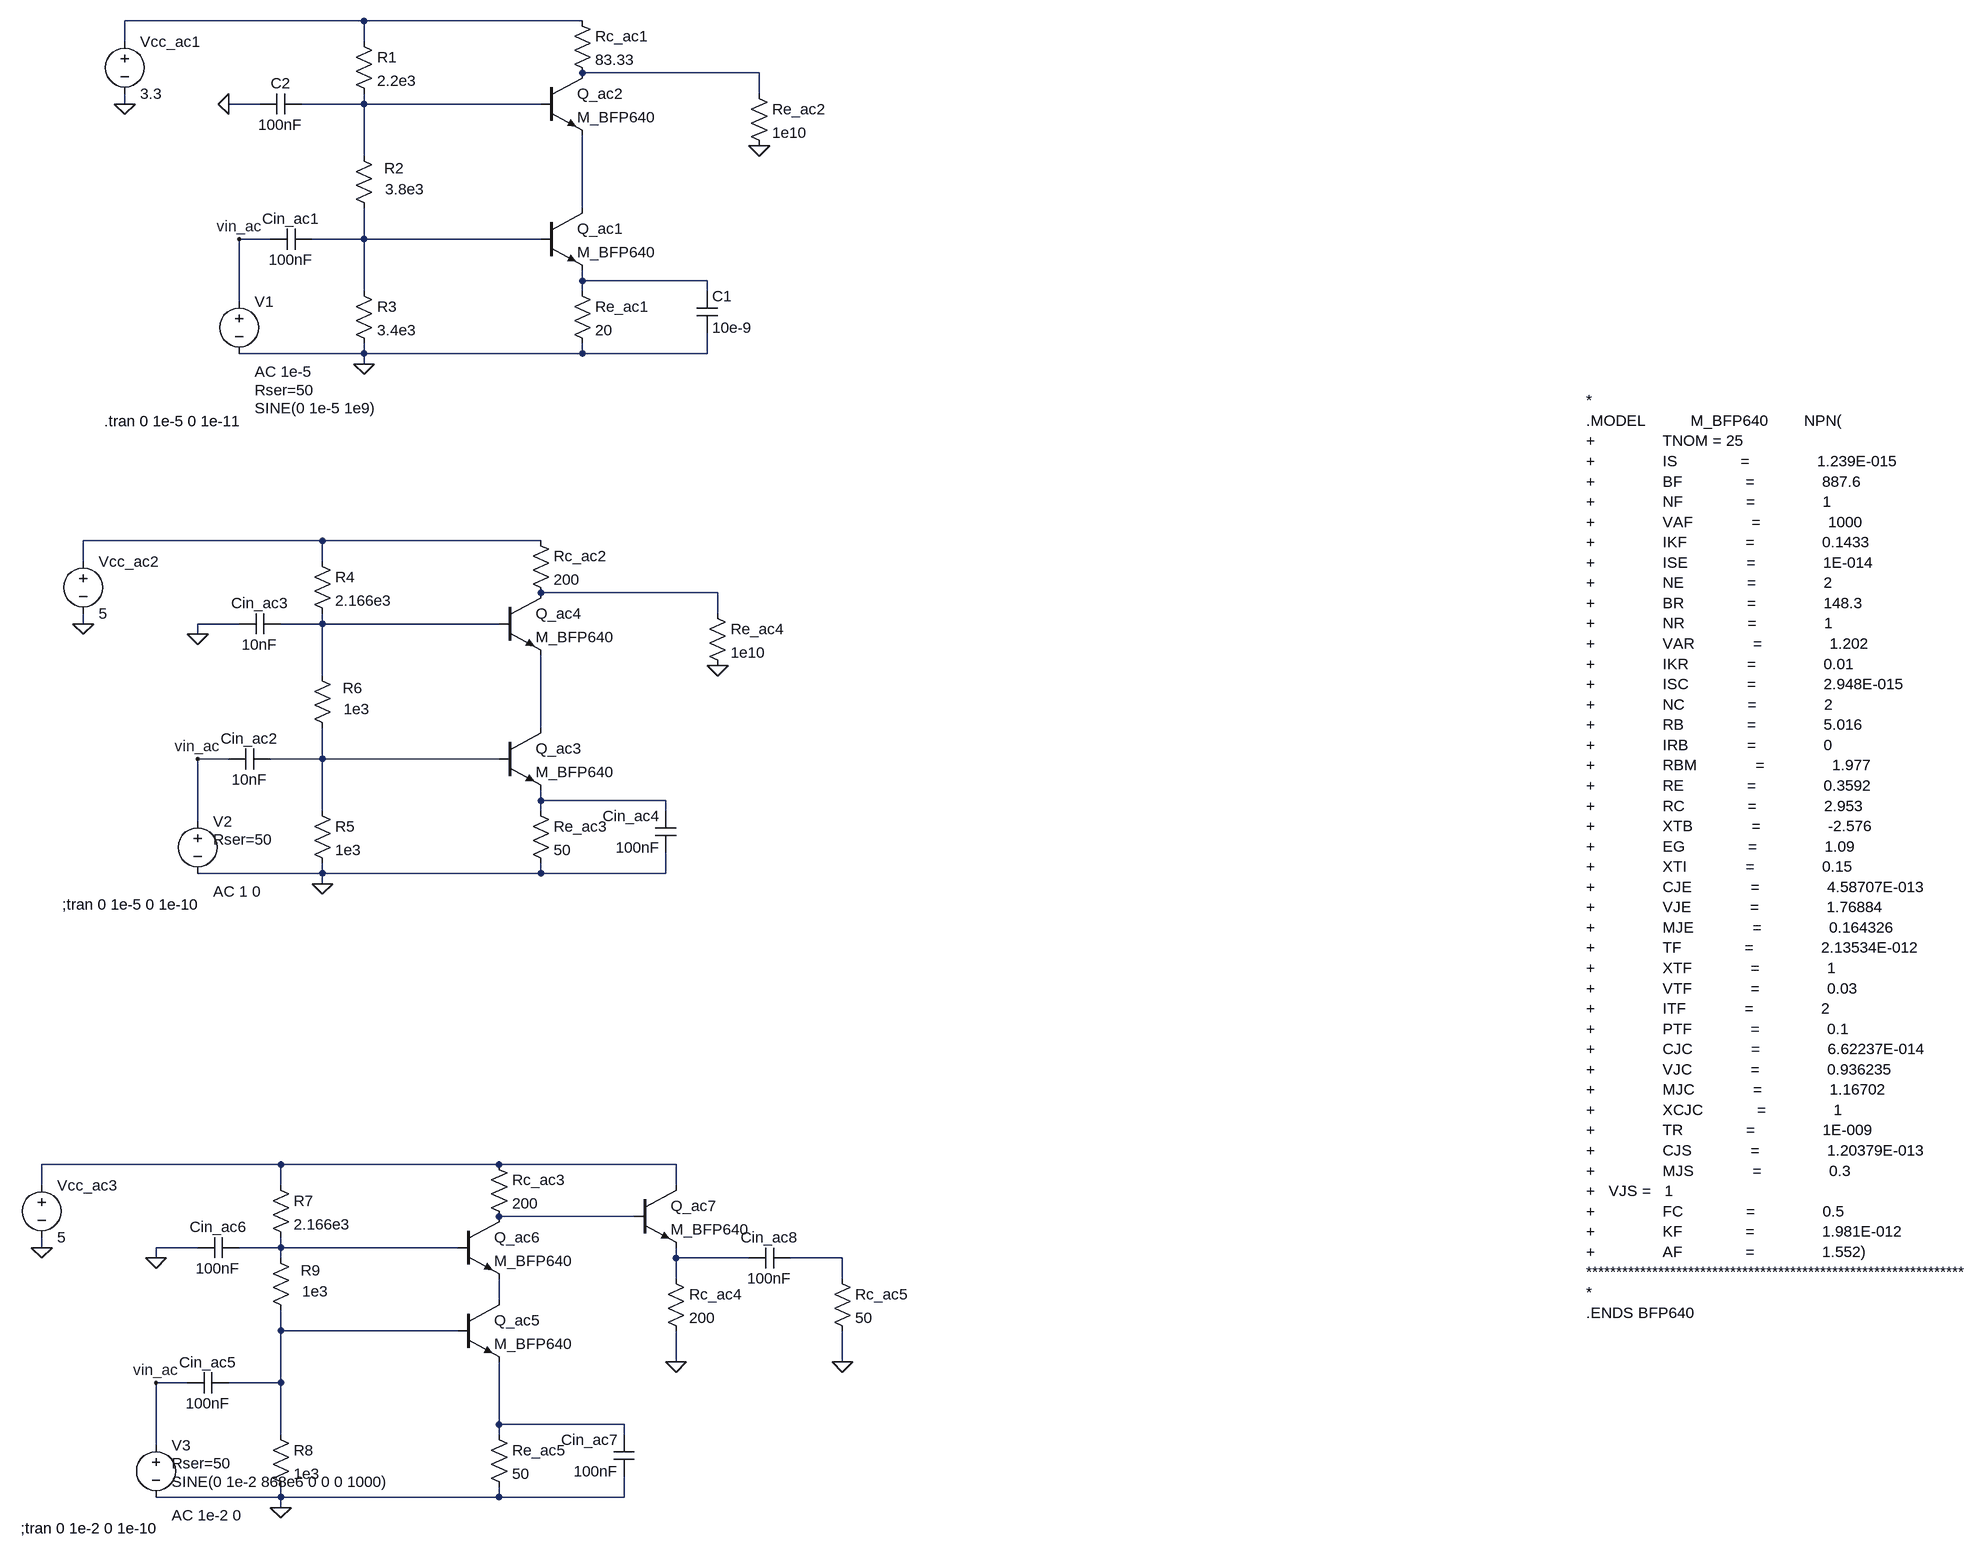
[diagram p0: schematic BP640_CASCODE.asc]
BP640_CASCODE.asc, the LTspice schematic file:
Version 4
SHEET 1 2516 2144
WIRE -288 -192 -656 -192
WIRE 48 -192 -288 -192
WIRE -656 -160 -656 -192
WIRE -288 -160 -288 -192
WIRE 320 -112 48 -112
WIRE 320 -80 320 -112
WIRE -656 -64 -656 -80
WIRE -448 -64 -496 -64
WIRE -288 -64 -288 -80
WIRE -288 -64 -384 -64
WIRE -16 -64 -288 -64
WIRE -288 16 -288 -64
WIRE 48 96 48 -16
WIRE -432 144 -480 144
WIRE -288 144 -288 96
WIRE -288 144 -368 144
WIRE -16 144 -288 144
WIRE 48 208 48 192
WIRE 240 208 48 208
WIRE -288 224 -288 144
WIRE 48 224 48 208
WIRE 240 224 240 208
WIRE -480 240 -480 144
WIRE -288 320 -288 304
WIRE -288 320 -480 320
WIRE 48 320 48 304
WIRE 48 320 -288 320
WIRE 240 320 240 288
WIRE 240 320 48 320
WIRE -288 336 -288 320
WIRE -352 608 -720 608
WIRE -16 608 -352 608
WIRE -720 640 -720 608
WIRE -352 640 -352 608
WIRE 256 688 -16 688
WIRE 256 720 256 688
WIRE -720 736 -720 720
WIRE -480 736 -544 736
WIRE -352 736 -352 720
WIRE -352 736 -416 736
WIRE -80 736 -352 736
WIRE -544 752 -544 736
WIRE -352 816 -352 736
WIRE -16 896 -16 784
WIRE -496 944 -544 944
WIRE -352 944 -352 896
WIRE -352 944 -432 944
WIRE -80 944 -352 944
WIRE -16 1008 -16 992
WIRE 176 1008 -16 1008
WIRE -352 1024 -352 944
WIRE -16 1024 -16 1008
WIRE 176 1024 176 1008
WIRE -544 1040 -544 944
WIRE -352 1120 -352 1104
WIRE -352 1120 -544 1120
WIRE -16 1120 -16 1104
WIRE -16 1120 -352 1120
WIRE 176 1120 176 1088
WIRE 176 1120 -16 1120
WIRE -352 1136 -352 1120
WIRE -416 1568 -784 1568
WIRE -80 1568 -416 1568
WIRE 192 1568 -80 1568
WIRE -784 1600 -784 1568
WIRE -416 1600 -416 1568
WIRE 192 1600 192 1568
WIRE 128 1648 -80 1648
WIRE -784 1696 -784 1680
WIRE -544 1696 -608 1696
WIRE -416 1696 -416 1680
WIRE -416 1696 -480 1696
WIRE -144 1696 -416 1696
WIRE -608 1712 -608 1696
WIRE -416 1712 -416 1696
WIRE 192 1712 192 1696
WIRE 304 1712 192 1712
WIRE 448 1712 368 1712
WIRE 192 1744 192 1712
WIRE 448 1744 448 1712
WIRE -80 1776 -80 1744
WIRE -416 1824 -416 1792
WIRE -144 1824 -416 1824
WIRE 192 1872 192 1824
WIRE 448 1872 448 1824
WIRE -560 1904 -608 1904
WIRE -416 1904 -416 1824
WIRE -416 1904 -496 1904
WIRE -80 1968 -80 1872
WIRE 112 1968 -80 1968
WIRE -416 1984 -416 1904
WIRE -80 1984 -80 1968
WIRE 112 1984 112 1968
WIRE -608 2000 -608 1904
WIRE -416 2080 -416 2064
WIRE -416 2080 -608 2080
WIRE -80 2080 -80 2064
WIRE -80 2080 -416 2080
WIRE 112 2080 112 2048
WIRE 112 2080 -80 2080
WIRE -416 2096 -416 2080
FLAG -656 -64 0
FLAG -288 336 0
FLAG -480 144 vin_ac
FLAG 320 0 0
FLAG -496 -64 0
FLAG -720 736 0
FLAG -352 1136 0
FLAG -544 944 vin_ac
FLAG 256 800 0
FLAG -544 752 0
FLAG -784 1696 0
FLAG -416 2096 0
FLAG -608 1904 vin_ac
FLAG -608 1712 0
FLAG 192 1872 0
FLAG 448 1872 0
SYMBOL voltage -656 -176 R0
WINDOW 123 0 0 Left 0
WINDOW 39 0 0 Left 0
SYMATTR InstName Vcc_ac1
SYMATTR Value 3.3
SYMBOL npn -16 96 R0
SYMATTR InstName Q_ac1
SYMATTR Value M_BFP640
SYMBOL res -304 -176 R0
SYMATTR InstName R1
SYMATTR Value 2.2e3
SYMBOL res -304 208 R0
SYMATTR InstName R3
SYMATTR Value 3.4e3
SYMBOL res 32 208 R0
SYMATTR InstName Re_ac1
SYMATTR Value 20
SYMBOL res 32 -208 R0
SYMATTR InstName Rc_ac1
SYMATTR Value 83.33
SYMBOL cap -368 128 R90
WINDOW 0 0 32 VBottom 2
WINDOW 3 32 32 VTop 2
SYMATTR InstName Cin_ac1
SYMATTR Value 100nF
SYMBOL res -304 0 R0
WINDOW 0 47 35 Left 2
WINDOW 3 49 67 Left 2
SYMATTR InstName R2
SYMATTR Value 3.8e3
SYMBOL npn -16 -112 R0
SYMATTR InstName Q_ac2
SYMATTR Value M_BFP640
SYMBOL res 304 -96 R0
SYMATTR InstName Re_ac2
SYMATTR Value 1e10
SYMBOL voltage -480 224 R0
WINDOW 3 24 180 Left 2
WINDOW 123 24 124 Left 2
WINDOW 39 24 152 Left 2
SYMATTR Value SINE(0 1e-5 1e9)
SYMATTR Value2 AC 1e-5
SYMATTR SpiceLine Rser=50
SYMATTR InstName V1
SYMBOL cap 224 224 R0
SYMATTR InstName C1
SYMATTR Value 10e-9
SYMBOL cap -384 -80 R90
WINDOW 0 0 32 VBottom 2
WINDOW 3 32 32 VTop 2
SYMATTR InstName C2
SYMATTR Value 100nF
SYMBOL voltage -544 1024 R0
WINDOW 123 24 124 Left 2
WINDOW 39 24 44 Left 2
SYMATTR Value2 AC 1 0
SYMATTR SpiceLine Rser=50
SYMATTR InstName V2
SYMATTR Value ""
SYMBOL voltage -720 624 R0
WINDOW 123 0 0 Left 0
WINDOW 39 0 0 Left 0
SYMATTR InstName Vcc_ac2
SYMATTR Value 5
SYMBOL npn -80 896 R0
SYMATTR InstName Q_ac3
SYMATTR Value M_BFP640
SYMBOL res -368 624 R0
SYMATTR InstName R4
SYMATTR Value 2.166e3
SYMBOL res -368 1008 R0
SYMATTR InstName R5
SYMATTR Value 1e3
SYMBOL res -32 1008 R0
SYMATTR InstName Re_ac3
SYMATTR Value 50
SYMBOL res -32 592 R0
SYMATTR InstName Rc_ac2
SYMATTR Value 200
SYMBOL cap -432 928 R90
WINDOW 0 0 32 VBottom 2
WINDOW 3 32 32 VTop 2
SYMATTR InstName Cin_ac2
SYMATTR Value 10nF
SYMBOL res -368 800 R0
WINDOW 0 47 35 Left 2
WINDOW 3 49 67 Left 2
SYMATTR InstName R6
SYMATTR Value 1e3
SYMBOL npn -80 688 R0
SYMATTR InstName Q_ac4
SYMATTR Value M_BFP640
SYMBOL res 240 704 R0
SYMATTR InstName Re_ac4
SYMATTR Value 1e10
SYMBOL cap -416 720 R90
WINDOW 0 0 32 VBottom 2
WINDOW 3 32 32 VTop 2
SYMATTR InstName Cin_ac3
SYMATTR Value 10nF
SYMBOL cap 192 1088 R180
WINDOW 0 24 56 Left 2
WINDOW 3 24 8 Left 2
SYMATTR InstName Cin_ac4
SYMATTR Value 100nF
SYMBOL voltage -608 1984 R0
WINDOW 123 24 124 Left 2
WINDOW 39 24 44 Left 2
WINDOW 3 24 72 Left 2
SYMATTR Value2 AC 1e-2 0
SYMATTR SpiceLine Rser=50
SYMATTR Value SINE(0 1e-2 868e6 0 0 0 1000)
SYMATTR InstName V3
SYMBOL voltage -784 1584 R0
WINDOW 123 0 0 Left 0
WINDOW 39 0 0 Left 0
SYMATTR InstName Vcc_ac3
SYMATTR Value 5
SYMBOL npn -144 1776 R0
SYMATTR InstName Q_ac5
SYMATTR Value M_BFP640
SYMBOL res -432 1584 R0
SYMATTR InstName R7
SYMATTR Value 2.166e3
SYMBOL res -432 1968 R0
SYMATTR InstName R8
SYMATTR Value 1e3
SYMBOL res -96 1968 R0
SYMATTR InstName Re_ac5
SYMATTR Value 50
SYMBOL res -96 1552 R0
SYMATTR InstName Rc_ac3
SYMATTR Value 200
SYMBOL cap -496 1888 R90
WINDOW 0 0 32 VBottom 2
WINDOW 3 32 32 VTop 2
SYMATTR InstName Cin_ac5
SYMATTR Value 100nF
SYMBOL res -432 1696 R0
WINDOW 0 47 35 Left 2
WINDOW 3 49 67 Left 2
SYMATTR InstName R9
SYMATTR Value 1e3
SYMBOL npn -144 1648 R0
SYMATTR InstName Q_ac6
SYMATTR Value M_BFP640
SYMBOL cap -480 1680 R90
WINDOW 0 0 32 VBottom 2
WINDOW 3 32 32 VTop 2
SYMATTR InstName Cin_ac6
SYMATTR Value 100nF
SYMBOL cap 128 2048 R180
WINDOW 0 24 56 Left 2
WINDOW 3 24 8 Left 2
SYMATTR InstName Cin_ac7
SYMATTR Value 100nF
SYMBOL npn 128 1600 R0
SYMATTR InstName Q_ac7
SYMATTR Value M_BFP640
SYMBOL res 176 1728 R0
SYMATTR InstName Rc_ac4
SYMATTR Value 200
SYMBOL cap 368 1696 R90
WINDOW 0 0 32 VBottom 2
WINDOW 3 32 32 VTop 2
SYMATTR InstName Cin_ac8
SYMATTR Value 100nF
SYMBOL res 432 1728 R0
SYMATTR InstName Rc_ac5
SYMATTR Value 50
TEXT -688 424 Left 2 !.tran 0 1e-5 0 1e-11
TEXT -752 1168 Left 2 !;tran 0 1e-5 0 1e-10
TEXT -816 2128 Left 2 !;tran 0 1e-2 0 1e-10
TEXT 1592 392 Left 2 !*\n.MODEL          M_BFP640        NPN(\n+               TNOM = 25\n+               IS              =               1.239E-015\n+               BF              =               887.6\n+               NF              =               1\n+               VAF             =               1000\n+               IKF             =               0.1433\n+               ISE             =               1E-014\n+               NE              =               2\n+               BR              =               148.3\n+               NR              =               1\n+               VAR             =               1.202\n+               IKR             =               0.01\n+               ISC             =               2.948E-015\n+               NC              =               2\n+               RB              =               5.016\n+               IRB             =               0\n+               RBM             =               1.977\n+               RE              =               0.3592\n+               RC              =               2.953\n+               XTB             =               -2.576\n+               EG              =               1.09\n+               XTI             =               0.15\n+               CJE             =               4.58707E-013\n+               VJE             =               1.76884\n+               MJE             =               0.164326\n+               TF              =               2.13534E-012\n+               XTF             =               1\n+               VTF             =               0.03\n+               ITF             =               2\n+               PTF             =               0.1\n+               CJC             =               6.62237E-014\n+               VJC             =               0.936235\n+               MJC             =               1.16702\n+               XCJC            =               1\n+               TR              =               1E-009\n+               CJS             =               1.20379E-013\n+               MJS             =               0.3\n+   VJS =   1\n+               FC              =               0.5\n+               KF              =               1.981E-012\n+               AF              =               1.552)\n***************************************************************\n*\n.ENDS BFP640

The netlist it stands for:
* BP640_CASCODE.asc
Vcc_ac1 N001 0 3.3
Q_ac1 N004 N005 N006 0 M_BFP640
R1 N001 N003 2.2e3
R3 N005 0 3.4e3
Re_ac1 N006 0 20
Rc_ac1 N001 N002 83.33
Cin_ac1 N005 vin_ac 100nF
R2 N003 N005 3.8e3
Q_ac2 N002 N003 N004 0 M_BFP640
Re_ac2 N002 0 1e10
V1 vin_ac 0 SINE(0 1e-5 1e9) AC 1e-5 Rser=50
C1 N006 0 10e-9
C2 N003 0 100nF
V2 vin_ac 0 AC 1 0 Rser=50
Vcc_ac2 N007 0 5
Q_ac3 N010 N011 N012 0 M_BFP640
R4 N007 N009 2.166e3
R5 N011 0 1e3
Re_ac3 N012 0 50
Rc_ac2 N007 N008 200
Cin_ac2 N011 vin_ac 10nF
R6 N009 N011 1e3
Q_ac4 N008 N009 N010 0 M_BFP640
Re_ac4 N008 0 1e10
Cin_ac3 N009 0 10nF
Cin_ac4 0 N012 100nF
V3 vin_ac 0 SINE(0 1e-2 868e6 0 0 0 1000) AC 1e-2 0 Rser=50
Vcc_ac3 N013 0 5
Q_ac5 N018 N019 N020 0 M_BFP640
R7 N013 N015 2.166e3
R8 N019 0 1e3
Re_ac5 N020 0 50
Rc_ac3 N013 N014 200
Cin_ac5 N019 vin_ac 100nF
R9 N015 N019 1e3
Q_ac6 N014 N015 N018 0 M_BFP640
Cin_ac6 N015 0 100nF
Cin_ac7 0 N020 100nF
Q_ac7 N013 N014 N016 0 M_BFP640
Rc_ac4 N016 0 200
Cin_ac8 N017 N016 100nF
Rc_ac5 N017 0 50
.model NPN NPN
.model PNP PNP
.lib standard.bjt
.tran 0 1e-5 0 1e-11
;tran 0 1e-5 0 1e-10
;tran 0 1e-2 0 1e-10
*
.MODEL          M_BFP640        NPN(
+               TNOM = 25
+               IS              =               1.239E-015
+               BF              =               887.6
+               NF              =               1
+               VAF             =               1000
+               IKF             =               0.1433
+               ISE             =               1E-014
+               NE              =               2
+               BR              =               148.3
+               NR              =               1
+               VAR             =               1.202
+               IKR             =               0.01
+               ISC             =               2.948E-015
+               NC              =               2
+               RB              =               5.016
+               IRB             =               0
+               RBM             =               1.977
+               RE              =               0.3592
+               RC              =               2.953
+               XTB             =               -2.576
+               EG              =               1.09
+               XTI             =               0.15
+               CJE             =               4.58707E-013
+               VJE             =               1.76884
+               MJE             =               0.164326
+               TF              =               2.13534E-012
+               XTF             =               1
+               VTF             =               0.03
+               ITF             =               2
+               PTF             =               0.1
+               CJC             =               6.62237E-014
+               VJC             =               0.936235
+               MJC             =               1.16702
+               XCJC            =               1
+               TR              =               1E-009
+               CJS             =               1.20379E-013
+               MJS             =               0.3
+   VJS =   1
+               FC              =               0.5
+               KF              =               1.981E-012
+               AF              =               1.552)
***************************************************************
*
.ENDS BFP640
.backanno
.end